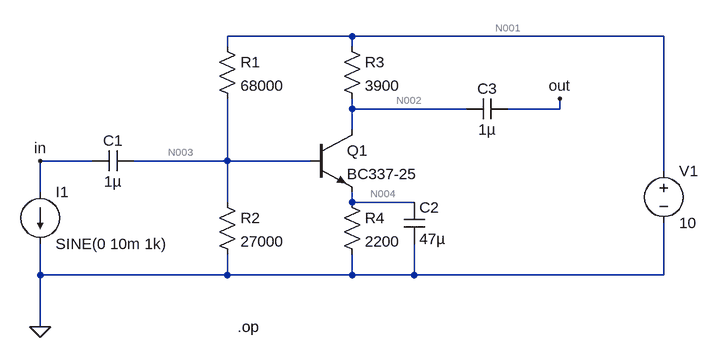
[diagram p0: schematic TP2.asc]
TP2.asc, the LTspice schematic file:
Version 4
SHEET 1 880 680
WIRE 320 16 128 16
WIRE 800 16 320 16
WIRE 128 32 128 16
WIRE 320 32 320 16
WIRE 320 128 320 112
WIRE 496 128 320 128
WIRE 640 128 640 112
WIRE 640 128 560 128
WIRE 320 160 320 128
WIRE -80 208 -160 208
WIRE 128 208 128 112
WIRE 128 208 -16 208
WIRE 256 208 128 208
WIRE 800 224 800 16
WIRE -160 256 -160 208
WIRE 128 272 128 208
WIRE 320 272 320 256
WIRE 416 272 320 272
WIRE -160 384 -160 336
WIRE 128 384 128 352
WIRE 128 384 -160 384
WIRE 320 384 320 352
WIRE 320 384 128 384
WIRE 416 384 416 336
WIRE 416 384 320 384
WIRE 800 384 800 304
WIRE 800 384 416 384
WIRE -160 464 -160 384
FLAG -160 464 0
FLAG 640 112 out
FLAG -160 208 in
SYMBOL res 112 16 R0
SYMATTR InstName R1
SYMATTR Value 68000
SYMBOL res 112 256 R0
SYMATTR InstName R2
SYMATTR Value 27000
SYMBOL res 304 16 R0
SYMATTR InstName R3
SYMATTR Value 3900
SYMBOL res 304 256 R0
SYMATTR InstName R4
SYMATTR Value 2200
SYMBOL cap -16 192 R90
WINDOW 0 0 32 VBottom 2
WINDOW 3 32 32 VTop 2
SYMATTR InstName C1
SYMATTR Value 1µ
SYMBOL cap 400 272 R0
SYMATTR InstName C2
SYMATTR Value 47µ
SYMBOL cap 560 112 R90
WINDOW 0 0 32 VBottom 2
WINDOW 3 32 32 VTop 2
SYMATTR InstName C3
SYMATTR Value 1µ
SYMBOL npn 256 160 R0
SYMATTR InstName Q1
SYMATTR Value BC337-25
SYMBOL voltage 800 208 R0
WINDOW 123 0 0 Left 0
WINDOW 39 0 0 Left 0
SYMATTR InstName V1
SYMATTR Value 10
SYMBOL current -160 256 R0
WINDOW 123 0 0 Left 0
WINDOW 39 0 0 Left 0
SYMATTR InstName I1
SYMATTR Value SINE(0 10m 1k)
TEXT 144 464 Left 2 !.op

The netlist it stands for:
* TP2.asc
R1 N001 N003 68000
R2 N003 0 27000
R3 N001 N002 3900
R4 N004 0 2200
C1 N003 in 1µ
C2 N004 0 47µ
C3 out N002 1µ
Q1 N002 N003 N004 0 BC337-25
V1 N001 0 10
I1 in 0 SINE(0 10m 1k)
.model NPN NPN
.model PNP PNP
.lib standard.bjt
.op
.backanno
.end

* Results of the author's LTspice run, read from the files saved beside the schematic
* Operating Point:
*   V(n001) = 10 V
*   V(n003) = 2.774 V
*   V(n002) = 6.173 V
*   V(n004) = 2.167 V
*   V(in) = 2.774 µV
*   V(out) = 6.173 µV
*   Ic(Q1) = 981.4 µA
*   Ib(Q1) = 3.508 µA
*   Ie(Q1) = -984.9 µA
*   I(C3) = 0 A
*   I(C2) = 0 A
*   I(C1) = 0 A
*   I(I1) = 0 A
*   I(R4) = 984.9 µA
*   I(R3) = 981.4 µA
*   I(R2) = 102.8 µA
*   I(R1) = 106.3 µA
*   I(V1) = -1.088 mA
* From the log:
*   Semiconductor Device Operating Points:
*                           --- Bipolar Transistors ---
*   Name:       q1
*   Model:   bc337-25
*   Ib:       3.51e-06
*   Ic:       9.81e-04
*   Vbe:      6.07e-01
*   Vbc:     -3.40e+00
*   Vce:      4.01e+00
*   BetaDC:   2.80e+02
*   Gm:       3.85e-02
*   Rpi:      7.31e+03
*   Rx:       5.80e+01
*   Ro:       1.47e+05
*   Cbe:      8.88e-11
*   Cbc:      2.49e-12
*   Cjs:      0.00e+00
*   BetaAC:   2.82e+02
*   Cbx:      2.98e-12
*   Ft:       6.50e+07